# Altium project PickNeck.PrjPcb
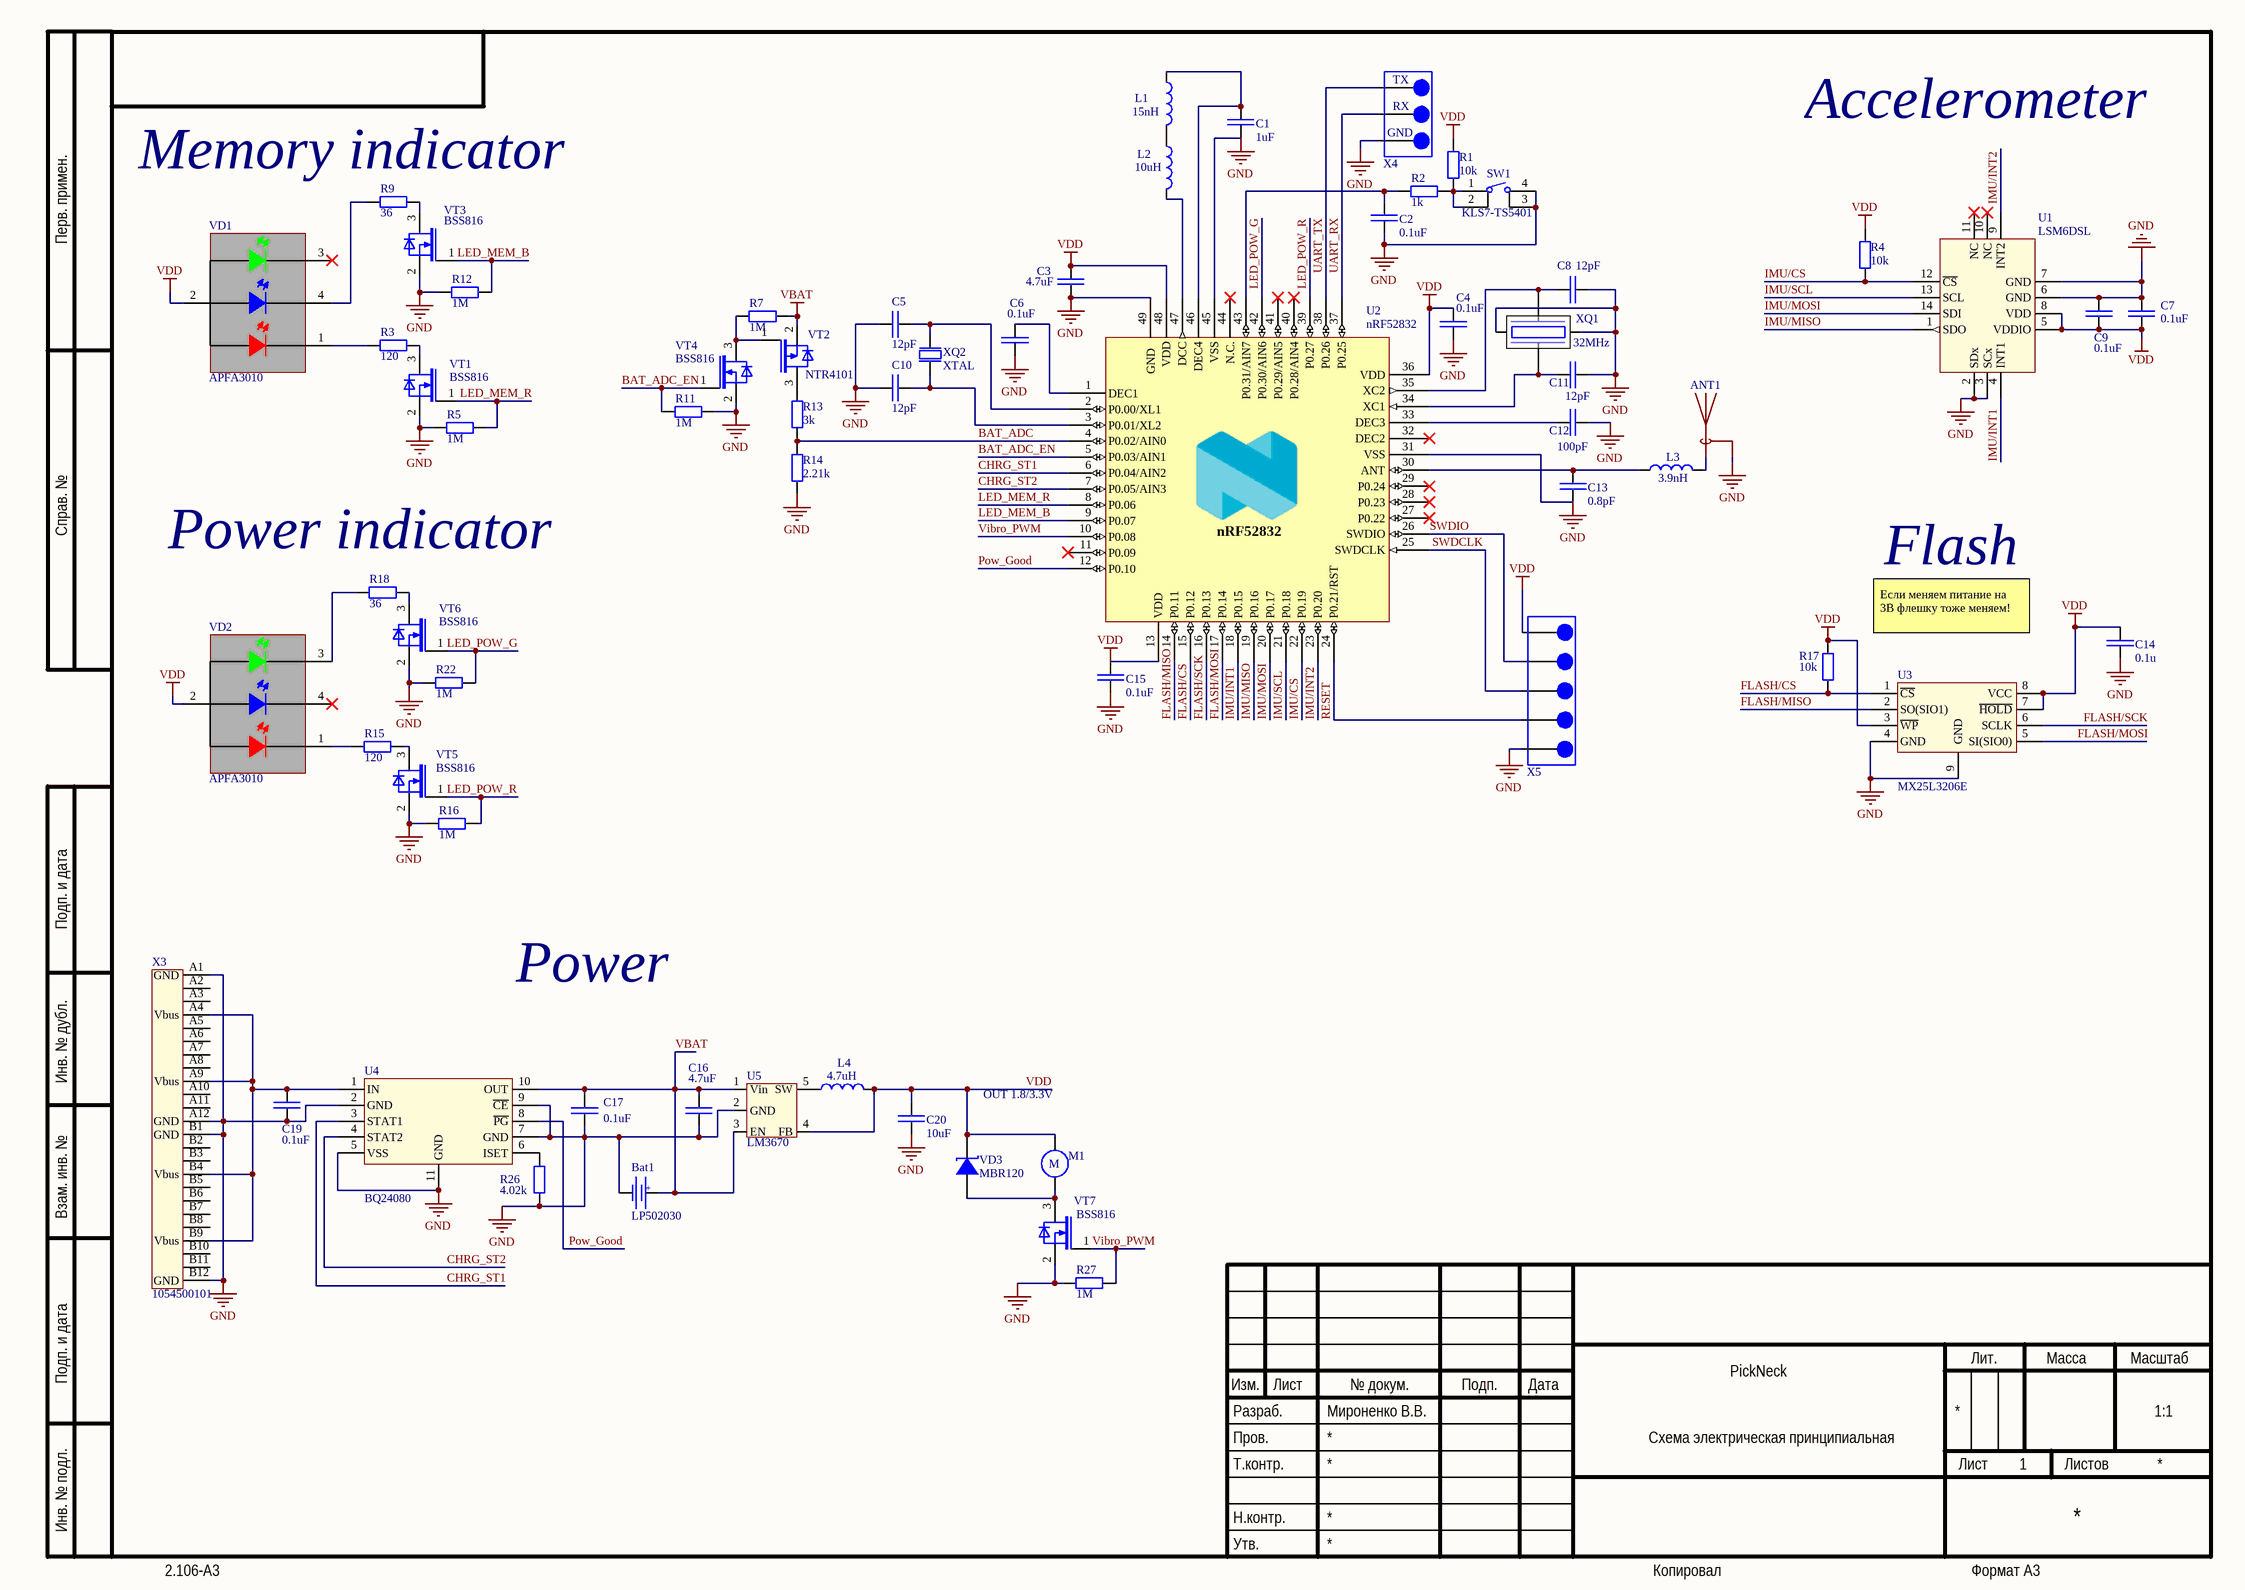
[diagram p0: PickNeck_SCH.SchDoc]
1 sheet, 65 parts. Net scope: global (net labels, ports and power ports of the same name join across sheets).
Board file: PickNeck_PCB.PcbDoc

## Sheet PickNeck_SCH.SchDoc: PickNeck
size 420 x 297 mm; Author: Мироненко В.В.; Address1: Address1; Address2: Address2; Address3: Address3; Address4: Address4; SheetNumber: 1; Scale: 1:1; DocumentType: Схема электрическая принципиальная; DocumentName: PickNeck

### Parts
ANT1  2.4-GHz Inverted F Antenna  [2.4-GHz Inverted F Antenna - 2 - duplicate]  (value not drawn)  (net tie, no BOM)
Bat1  LP502030  [BAT]
C1  1uF  [SMD0603CAP]
C2  0.1uF  [SMD0402CAP]
C3  4.7uF  [SMD0603CAP]
C4  0.1uF  [SMD0402CAP]
C5  12pF  [SMD0402CAP]
C6  0.1uF  [SMD0402CAP]
C7  0.1uF  [SMD0402CAP]
C8  12pF  [SMD0402CAP]
C9  0.1uF  [SMD0402CAP]
C10  12pF  [SMD0402CAP]
C11  12pF  [SMD0402CAP]
C12  100pF  [SMD0402CAP]
C13  0.8pF  [SMD0402CAP]
C14  0.1u  [SMD0402CAP]
C15  0.1uF  [SMD0402CAP]
C16  4.7uF  [SMD0603CAP]
C17  0.1uF  [SMD0603CAP]
C19  0.1uF  [SMD0603CAP]
C20  10uF  [SMD0603CAP]
L1  15nH  [SMD0402IND]
L2  10uH  [SMD0603IND]
L3  3.9nH  [SMD0402IND]
L4  4.7uH  [SMD0805IND]
M1  (no value)  [VIBRO]
R1  10k  [SMD0402RES]
R2  1k  [SMD0402RES]
R3  120  [SMD0402RES]
R4  10k  [SMD0402RES]
R5  1M  [SMD0402RES]
R7  1M  [SMD0402RES]
R9  36  [SMD0402RES]
R11  1M  [SMD0402RES]
R12  1М  [SMD0402RES]
R13  3k  [SMD0402RES]
R14  2.21k  [SMD0402RES]
R15  120  [SMD0402RES]
R16  1M  [SMD0402RES]
R17  10k  [SMD0402RES]
R18  36  [SMD0402RES]
R22  1M  [SMD0402RES]
R26  4.02k  [SMD0603RES]
R27  1M  [SMD0402RES]
SW1  KLS7-TS5401  [KLS7-TS5401]
U1  LSM6DSL  [LGA-14L]
U2  nRF52832  [QFN40P600X600X90-48N]
U3  MX25L3206E  [USON-8]
U4  BQ24080  [VSON10]
U5  LM3670  [SOT23-5]
VD1  APFA3010  [SMD_LED3010]
VD2  APFA3010  [SMD_LED3010]
VD3  MBR120  [SOD-123]
VT1  BSS816  [SOT-323]
VT2  NTR4101  [SOT23-3P]
VT3  BSS816  [SOT-323]
VT4  BSS816  [SOT-323]
VT5  BSS816  [SOT-323]
VT6  BSS816  [SOT-323]
VT7  BSS816  [SOT-323]
X3  1054500101  [1054500101]
X4  (no value)  [UART_POINTS]
X5  (no value)  [SWD_POINTS]
XQ1  32MHz  [XTAL_2016]
XQ2  XTAL  [XTAL_3215]

### Nets
GND: ANT1.1(GND) Bat1.2 C1.1 C2.1 C3.1 C4.1 C5.1 C6.1 C7.1 C8.1 C9.1 C10.1 C11.1 C12.2 C13.1 C14.1 C15.1 C16.1 C17.1 C19.1 C20.1 R5.1 R11.2 R12.1 R14.1 R16.1 R22.1 R26.1 R27.1 SW1.3 SW1.4 U1.2(SDx) U1.3(SCx) U1.6(GND) U1.7(GND) U2.31(VSS) U2.45(VSS) U2.49(GND) U3.4(GND) U3.9(GND) U4.2(GND) U4.5(VSS) U4.7(GND) U4.9(~{CE}) U4.11(GND) U5.2(GND) VT1.2(S) VT3.2(S) VT4.2(S) VT5.2(S) VT6.2(S) VT7.2(S) X3.A1(GND) X3.A12(GND) X3.B1(GND) X3.B12(GND) X4.3 X5.5 XQ1.2 XQ1.4
VBAT: Bat1.1 C16.2 C17.2 R7.2 U4.10(OUT) U5.1(Vin) U5.3(EN) VT2.2(S)
VDD: C3.2 C4.2 C7.2 C9.2 C14.2 C15.2 C20.2 L4.2 M1.1 R1.2 R4.2 R17.2 U1.5(VDDIO) U1.8(VDD) U2.13(VDD) U2.36(VDD) U2.48(VDD) U3.3(~{WP}) U3.7(~{HOLD}) U3.8(VCC) U5.4(FB) VD1.2 VD2.2 VD3.2 X5.1
BAT_ADC: R13.1 R14.2 U2.4(P0.02/AIN0)
BAT_ADC_EN: R11.1 U2.5(P0.03/AIN1) VT4.1(G)
CHRG_ST1: U2.6(P0.04/AIN2) U4.3(STAT1)
CHRG_ST2: U2.7(P0.05/AIN3) U4.4(STAT2)
FLASH/CS: R17.1 U2.15(P0.12) U3.1(~{CS})
FLASH/MISO: U2.14(P0.11) U3.2(SO(SIO1))
FLASH/MOSI: U2.17(P0.14) U3.5(SI(SIO0))
FLASH/SCK: U2.16(P0.13) U3.6(SCLK)
IMU/CS: R4.1 U1.12(~{CS}) U2.22(P0.19)
IMU/INT1: U1.4(INT1) U2.18(P0.15)
IMU/INT2: U1.9(INT2) U2.23(P0.20)
IMU/MISO: U1.1(SDO) U2.19(P0.16)
IMU/MOSI: U1.14(SDI) U2.20(P0.17)
IMU/SCL: U1.13(SCL) U2.21(P0.18)
LED_MEM_B: R12.2 U2.9(P0.07) VT3.1(G)
LED_MEM_R: R5.2 U2.8(P0.06) VT1.1(G)
LED_POW_G: R22.2 U2.42(P0.30/AIN6) VT6.1(G)
LED_POW_R: R16.2 U2.39(P0.27) VT5.1(G)
Pow_Good: U2.12(P0.10) U4.8(~{PG})
RESET: U2.24(P0.21/RST) X5.4
SWDCLK: U2.25(SWDCLK) X5.3
SWDIO: U2.26(SWDIO) X5.2
UART_RX: U2.37(P0.25) X4.2
UART_TX: U2.38(P0.26) X4.1
Vibro_PWM: R27.2 U2.10(P0.08) VT7.1(G)
NetANT1_2: ANT1.2(FEED) L3.2
NetC1_2: C1.2 L1.1 U2.46(DEC4)
NetC2_2: C2.2 R2.1 U2.43(P0.31/AIN7)
NetC5_2: C5.2 U2.2(P0.00/XL1) XQ2.2
NetC6_2: C6.2 U2.1(DEC1)
NetC8_2: C8.2 U2.35(XC2) XQ1.3
NetC10_2: C10.2 U2.3(P0.01/XL2) XQ2.1
NetC11_2: C11.2 U2.34(XC1) XQ1.1
NetC12_1: C12.1 U2.33(DEC3)
NetC13_2: C13.2 L3.1 U2.30(ANT)
NetC19_2: C19.2 U4.1(IN) X3.A4(Vbus) X3.A9(Vbus) X3.B4(Vbus) X3.B9(Vbus)
NetL1_2: L1.2 L2.1
NetL2_2: L2.2 U2.47(DCC)
NetL4_1: L4.1 U5.5(SW)
NetM1_2: M1.2 VD3.1 VT7.3(D)
NetR1_1: R1.1 R2.2 SW1.1 SW1.2
NetR3_1: R3.1 VD1.1
NetR3_2: R3.2 VT1.3(D)
NetR7_1: R7.1 VT2.1(G) VT4.3(D)
NetR9_1: R9.1 VD1.4
NetR9_2: R9.2 VT3.3(D)
NetR13_2: R13.2 VT2.3(D)
NetR15_1: R15.1 VD2.1
NetR15_2: R15.2 VT5.3(D)
NetR18_1: R18.1 VD2.3
NetR18_2: R18.2 VT6.3(D)
NetR26_2: R26.2 U4.6(ISET)

Not connected (* = marked no-connect by the designer): U1 10(NC)* 11(NC)*; U2 11(P0.09)* 27(P0.22)* 28(P0.23)* 29(P0.24)* 32(DEC2)* 40(P0.28/AIN4)* 41(P0.29/AIN5)* 44(N.C.)*; VD1 3*; VD2 4*; X3 A2(2) A3(3) A5(5) A6(6) A7(7) A8(8) A10(10) A11(11) B2(14) B3(15) B5(17) B6(18) B7(19) B8(20) B10(22) B11(23)

### Notes on the sheet
- (near R9) Memory indicator
- Accelerometer
- Перв. примен.
- Справ. №
- (near R18) Power indicator
- Flash
- Если меняем питание на 3В флешку тоже меняем!
- Подп. и дата
- Power
- Инв. № дубл.
- OUT 1.8/3.3V
- Взам. инв. №
- Разраб.
- Изм.
- Лист
- № докум.
- Подп.
- Дата
- Лит.
- Масса
- Масштаб
- Пров.
- Т.контр.
- Листов
- Инв. № подл.
- Утв.
- Н.контр.
- 2.106-A3
- Копировал
- Формат А3
- (in symbol Battery) +
- (in symbol RESERV_UART) TX; RX; GND
- (in symbol Vibromotor) M

### Library data of the parts
ANT1 = BLE ANT: 2.4Ghz PCB; Type Rus: Антенна; Description Doc: 2.4Ghz PCB; Type Eng: Antenna; Value: 2.4-GHz Inverted F Antenna
Bat1 = Battery: Battery connector; Manufacturer: Comfortable Electronic; Type Rus: Элемент питания; Footprint Doc: Batteryconnector; Part Number: LP502030; Type Eng: Battery; Value: LP502030
C1 = CAP_CER_SMD: Chip Capacitor; Part Number: CL10B105KO8NNNC; Manufacturer: SAMSUNG; Description Doc: CERAMIC 16V X7R; Type Eng: Capactior; Type Rus: Конденсатор; Footprint Doc: 0603; Value: 1uF
C2 C6 C7 C9 C14 C15 = CAP_CER_SMD: Chip Capacitor; Part Number: CC0402KRX7R6BB104; Manufacturer: YAGEO; Description Doc: CERAMIC 10V X7R; Type Eng: Capactior; Type Rus: Конденсатор; Footprint Doc: 0402
  C2 C6 C7 C9 C15: Value: 0.1uF
  C14: Value: 0.1u
C3 = CAP_CER_SMD: Chip Capacitor; Part Number: CL10A475KP8NNNC; Manufacturer: SAMSUNG; Description Doc: CERAMIC 10V X5R; Type Eng: Capactior; Type Rus: Конденсатор; Footprint Doc: 0603; Value: 4.7uF
C4 = CAP_CER_SMD: Chip Capacitor; Part Number: CC0402KRX7R6BB104; Manufacturer: YAGEO; Description Doc: CERAMIC 10V NP0; Type Eng: Capactior; Type Rus: Конденсатор; Footprint Doc: 0402; Value: 0.1uF
C5 C8 C11 = CAP_CER_SMD: Chip Capacitor; Part Number: CC0402GRNPO9BN120; Manufacturer: YAGEO; Description Doc: CERAMIC 50V NP0; Type Eng: Capactior; Type Rus: Конденсатор; Footprint Doc: 0402; Value: 12pF
C10 = CAP_CER_SMD: Chip Capacitor; Part Number: CC0402GRNPO9BN120; Manufacturer: YAGEO; Description Doc: NP0; Type Eng: Capactior; Type Rus: Конденсатор; Footprint Doc: 0402; Value: 12pF
C12 = CAP_CER_SMD: Chip Capacitor; Part Number: CC0402JRNPO9BN101; Manufacturer: YAGEO; Description Doc: CERAMIC 50V NP0; Type Eng: Capactior; Type Rus: Конденсатор; Footprint Doc: 0402; Value: 100pF
C13 = CAP_CER_SMD: Chip Capacitor; Part Number: CC0402BRNPO9BNR80; Manufacturer: YAGEO; Description Doc: CERAMIC 50V NP0; Type Eng: Capactior; Type Rus: Конденсатор; Footprint Doc: 0402; Value: 0.8pF
C16 = CAP_CER_SMD: Chip Capacitor; Part Number: CL10A475KP8NNNC; Manufacturer: SAMSUNG; Description Doc: CERAMIC 16V X7R; Type Eng: Capactior; Type Rus: Конденсатор; Footprint Doc: 0603; Value: 4.7uF
C17 C19 = CAP_CER_SMD: Chip Capacitor; Part Number: CC0603KRX7R7BB104; Manufacturer: YAGEO; Description Doc: CERAMIC 16V X7R; Type Eng: Capactior; Type Rus: Конденсатор; Footprint Doc: 0603; Value: 0.1uF
C20 = CAP_CER_SMD: Chip Capacitor; Part Number: CL10A106KP8NNNC; Manufacturer: SAMSUNG; Description Doc: CERAMIC 10V X5R; Type Eng: Capactior; Type Rus: Конденсатор; Footprint Doc: 0603; Value: 10uF
L1 = IND_SMD: Chip Coil; Part Number: HK100515NK-T; Manufacturer: TAIYO; Type Rus: Индуктивность; Description Doc: 320mA 100MHz; Value: 15nH; Type Eng: Coil; Footprint Doc: 0402
L2 = IND_SMD: Chip Coil; Part Number: BRL1608T100M; Manufacturer: TAIYO; Type Rus: Индуктивность; Description Doc: 220mA 45MHz; Value: 10uH; Type Eng: Coil; Footprint Doc: 0603
L3 = IND_SMD: Chip Coil; Part Number: CW100505-3N9J; Manufacturer: BOURNS; Type Rus: Индуктивность; Description Doc: 0.84A 5800MHz; Value: 3.9nH; Type Eng: Coil; Footprint Doc: 0402
L4 = IND_SMD: Chip Coil; Part Number: MLP2012S4R7M; Manufacturer: TDK; Type Rus: Индуктивность; Description Doc: 0.7A 10MHz; Value: 4.7uH; Type Eng: Coil; Footprint Doc: 0805
M1 = Vibromotor: Vibration motor; Manufacturer: QX-Motor; Part Number: QX-4A; Type Rus: Вибромотор; Type Eng: Vibration motor
R1 R4 R17 = RES_CHIP_SMD: Chip Resistor; Part Number: RC0402JR-0710KL; Manufacturer: YAGEO; Type Rus: Резистор; Description Doc: 0.063W 5%; Type Eng: Resistor; Footprint Doc: 0402; Value: 10k
R2 = RES_CHIP_SMD: Chip Resistor; Part Number: RC0402JR-071KL; Manufacturer: YAGEO; Type Rus: Резистор; Description Doc: 0.1W 5%; Type Eng: Resistor; Footprint Doc: 0402; Value: 1k
R3 R15 = RES_CHIP_SMD: Chip Resistor; Part Number: RC0402FR-07120RL; Manufacturer: YAGEO; Type Rus: Резистор; Description Doc: 0.063W 1%; Type Eng: Resistor; Footprint Doc: 0603; Value: 120
R5 R7 R11 R16 R22 R27 = RES_CHIP_SMD: Chip Resistor; Part Number: RC0402FR-071ML; Manufacturer: YAGEO; Type Rus: Резистор; Description Doc: 0.063W 1%; Type Eng: Resistor; Footprint Doc: 0402; Value: 1M
R9 R18 = RES_CHIP_SMD: Chip Resistor; Part Number: RC0402FR-0736RL; Manufacturer: YAGEO; Type Rus: Резистор; Description Doc: 0.063W 1%; Type Eng: Resistor; Value: 36
  R9: Footprint Doc: 0603
  R18: Footprint Doc: 0402
R12 = RES_CHIP_SMD: Chip Resistor; Part Number: RC0402FR-071ML; Manufacturer: YAGEO; Type Rus: Резистор; Description Doc: 0.1W 5%; Type Eng: Resistor; Footprint Doc: 0402; Value: 1М
R13 = RES_CHIP_SMD: Chip Resistor; Part Number: RC0402FR-073KL; Manufacturer: YAGEO; Type Rus: Резистор; Description Doc: 0.063W 1%; Type Eng: Resistor; Footprint Doc: 0402; Value: 3k
R14 = RES_CHIP_SMD: Chip Resistor; Part Number: RC0402FR-072K21L; Manufacturer: YAGEO; Type Rus: Резистор; Description Doc: 0.063W 1%; Type Eng: Resistor; Footprint Doc: 0402; Value: 2.21k
R26 = RES_CHIP_SMD: Chip Resistor; Part Number: RC0603FR-074K02L; Manufacturer: YAGEO; Type Rus: Резистор; Description Doc: 0.1W 1%; Type Eng: Resistor; Footprint Doc: 0603; Value: 4.02k
SW1 = KLS7-TS5401: Button TACT SIDE; Part Number: KLS7-TS5401-1.35-250-T; Manufacturer: KLS; Type Rus: Кнопка; Description Doc: TACT 12V 50mA NO; Type Eng: Button; Footprint Doc: SMD; Value: KLS7-TS5401
U1 = LSM6DSL: Accelerometer; Manufacturer: STMicroelectronics; Type Eng: Integrated circuit; Type Rus: Микросхема; Footprint Doc: LGA-14; Part Number: LSM6DSL; Value: LSM6DSL
U2 = nRF52832_QFAA: Manufacturer: Nordic; Part Number: nRF52832-QFAA; Type Eng: Integrated circuit; Type Rus: Микросхема; Footprint Doc: QFAA; Value: nRF52832
U3 = MX25L3206E: Flash memory; Manufacturer: Macronix International; Part Number: MX25L3206EZUI-12G; Type Eng: Integrated circuit; Type Rus: Микросхема; Footprint Doc: USON-8; Value: MX25L3206E
U4 = BQ24080: Battery charger IC; Manufacturer: TEXAS INSTRUMETNS; Part Number: BQ24080DRC; Type Eng: Integrated Circuit; Type Rus: Микросхема; Footprint Doc: VSON10; Value: BQ24080
U5 = LM3670: Buck converter; Manufacturer: TEXAS INSTRUMENTS; Part Number: LM3670MF-3.3/NOPB; Type Eng: Integrated circuit; Type Rus: Микросхема; Footprint Doc: SOT23-5; Value: LM3670
VD1 VD2 = SMD_RGB: RGB SMD; Part Number: APFA3010SEEZGQBDC; Manufacturer: Kingbright; Description Doc: RGB_SMD; Type Eng: LED; Type Rus: Светодиод; Footprint Doc: 3010_SMD_RGB; Value: APFA3010
VD3 = SMD_SHOTTKY: Rectifier Diode; Part Number: MBR120LSFT1; Manufacturer: ON Semiconductor; Description Doc: SHOTTKY 1A 20V; Type Rus: Диод; Footprint Doc: SOD-123FL; Type Eng: Diode; Value: MBR120
VT1 VT3-VT7 = N-FET: Part Number: BSS816NW; Manufacturer: Infineon; Type Eng: Transistor; Type Rus: Транзистор; Description Doc: N-FET 1.4A 20V; Footprint Doc: SOT-323-3; Value: BSS816
VT2 = P-FET: Part Number: NTR4101PT1G; Manufacturer: ON Semiconductor; Type Eng: Transistor; Type Rus: Транзистор; Description Doc: P-FET 1.8A 20V; Footprint Doc: SOT23-3; Value: NTR4101
X3 = USB Type-C: Manufacturer: Molex; Type Eng: Connector; Type Rus: Разъем; Footprint Doc: USB-TypeC; Part Number: 1054500101; Value: 1054500101
X4 = RESERV_UART: Test Point
X5 = SWD_CONNECTOR: Pad for SWD
XQ1 = XRCGBxx: SMD Quartz rezonator; Part Number: Q22FA12800025; Manufacturer: EPSON; Type Eng: Quartz resonator; Type Rus: Кварцевый резонатор; Description Doc: 8pF, 10ppm; Footprint Doc: XTAL_2016; Value: 32MHz
XQ2 = XTAL: Manufacturer: EPSON; Part Number: FC-135 32.768KHz ±20ppm 9pF; Description Doc: 9pF, 20ppm; Type Eng: Quartz resonator; Type Rus: Кварцевый резонатор; Value: 32.768MHz; Footprint Doc: XTAL_3215